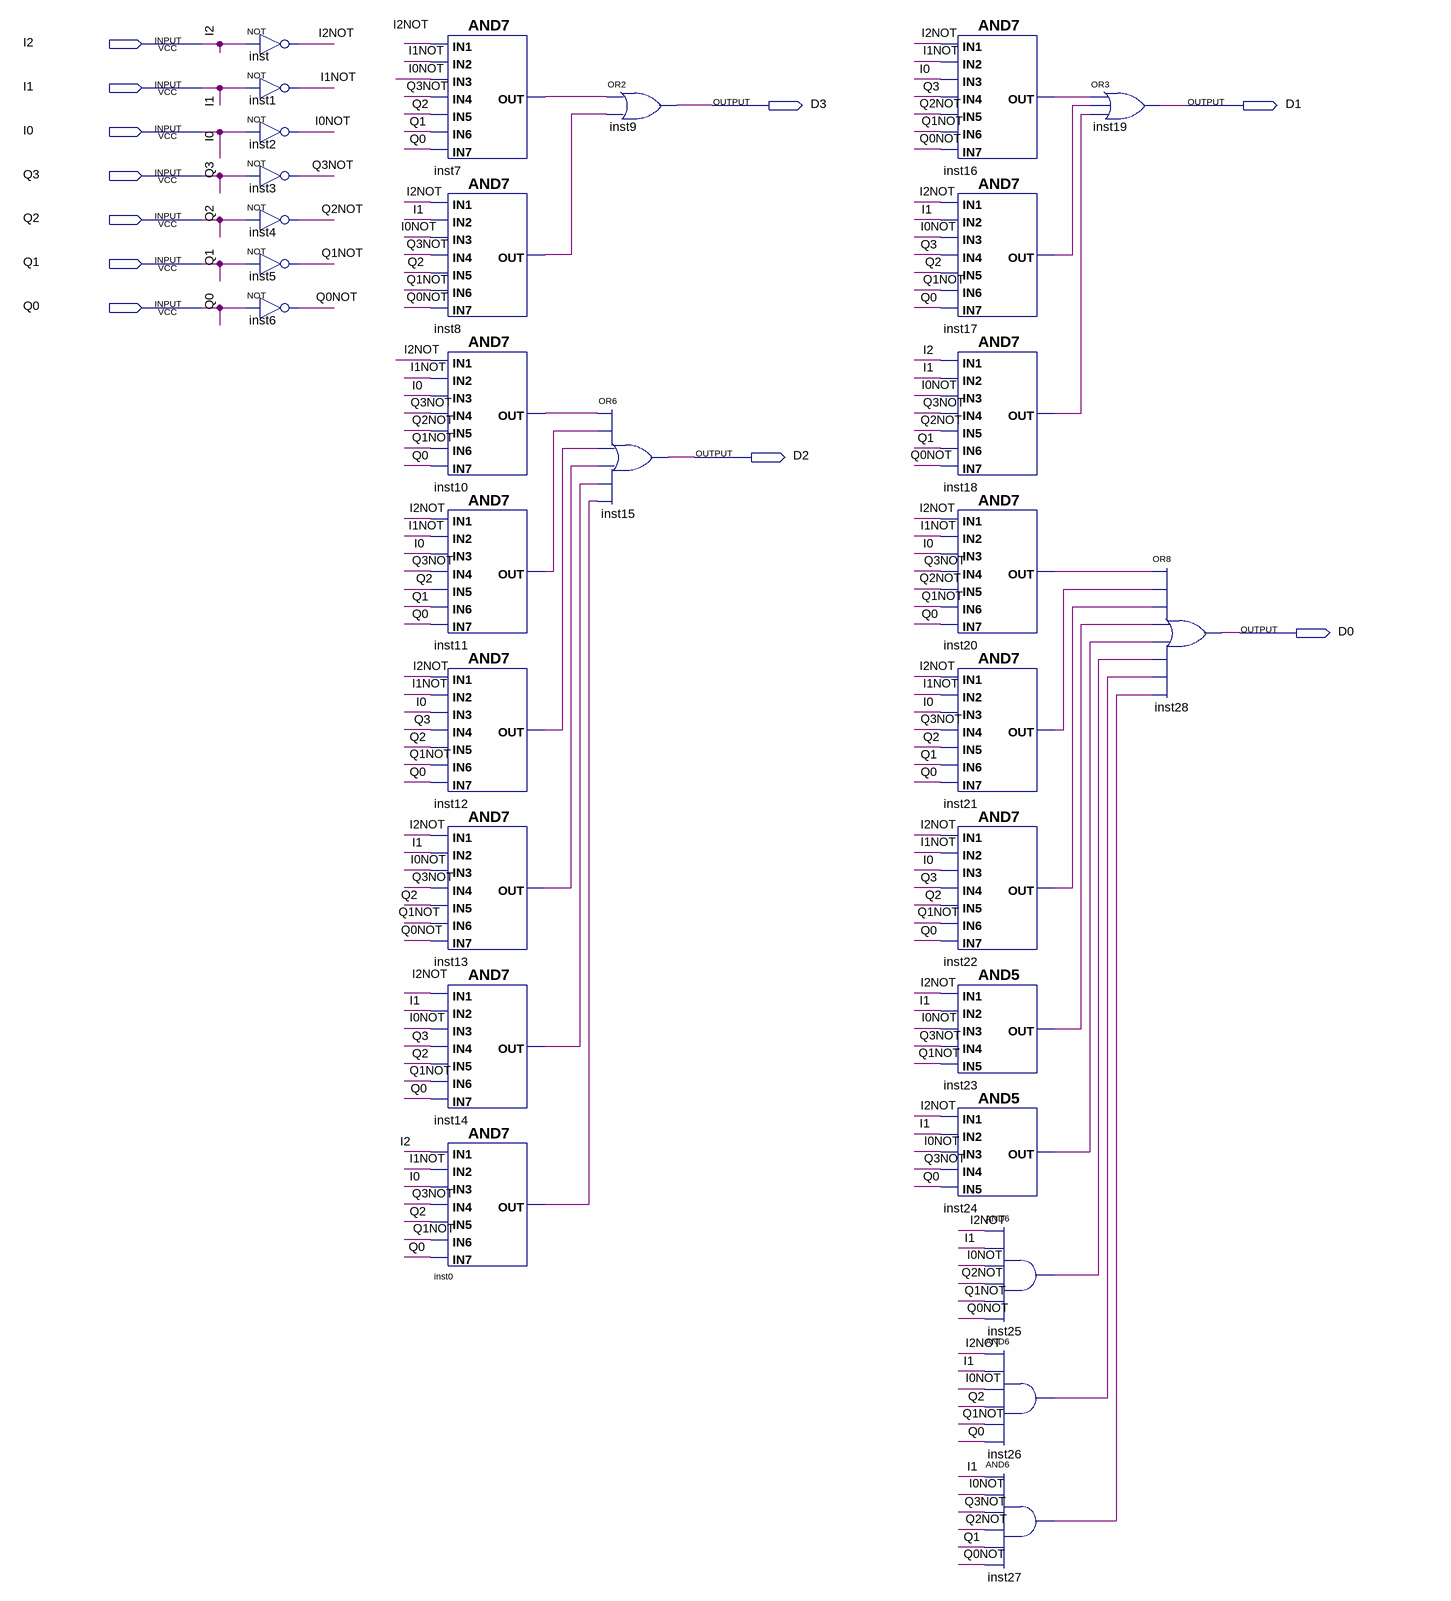
[diagram p0: schematic sheet]
// Quartus schematic NEXTSTATE.bdf as structural Verilog: 30 symbols, 11 pins
module NEXTSTATE (
  input  I2,
  input  I1,
  input  I0,
  input  Q3,
  input  Q2,
  input  Q1,
  input  Q0,
  output D3,
  output D1,
  output D2,
  output D0
);

  wire I0NOT, I1NOT, I2NOT, inst0_out, inst7_out, inst8_out, inst10_out, inst11_out, inst12_out, inst13_out,
       inst14_out, inst16_out, inst17_out, inst18_out, inst20_out, inst21_out, inst22_out, inst23_out,
       inst24_out, inst25_out, inst26_out, inst27_out, Q0NOT, Q1NOT, Q2NOT, Q3NOT;

  not inst (I2NOT, I2);
  not inst1 (I1NOT, I1);
  not inst2 (I0NOT, I0);
  not inst3 (Q3NOT, Q3);
  not inst4 (Q2NOT, Q2);
  not inst5 (Q1NOT, Q1);
  not inst6 (Q0NOT, Q0);
  and inst7 (inst7_out, I2NOT, I1NOT, I0NOT, Q3NOT, Q2, Q1, Q0);
  and inst8 (inst8_out, I2NOT, I1, I0NOT, Q3NOT, Q2, Q1NOT, Q0NOT);
  and inst10 (inst10_out, I2NOT, I1NOT, I0, Q3NOT, Q2NOT, Q1NOT, Q0);
  and inst11 (inst11_out, I2NOT, I1NOT, I0, Q3NOT, Q2, Q1, Q0);
  and inst12 (inst12_out, I2NOT, I1NOT, I0, Q3, Q2, Q1NOT, Q0);
  and inst13 (inst13_out, I2NOT, I1, I0NOT, Q3NOT, Q2, Q1NOT, Q0NOT);
  and inst14 (inst14_out, I2NOT, I1, I0NOT, Q3, Q2, Q1NOT, Q0);
  and inst0 (inst0_out, I2, I1NOT, I0, Q3NOT, Q2, Q1NOT, Q0);
  or inst9 (D3, inst7_out, inst8_out);
  or inst15 (D2, inst10_out, inst11_out, inst12_out, inst13_out, inst14_out, inst0_out);
  and inst16 (inst16_out, I2NOT, I1NOT, I0, Q3, Q2NOT, Q1NOT, Q0NOT);
  and inst17 (inst17_out, I2NOT, I1, I0NOT, Q3, Q2, Q1NOT, Q0);
  and inst18 (inst18_out, I2, I1, I0NOT, Q3NOT, Q2NOT, Q1, Q0NOT);
  and inst20 (inst20_out, I2NOT, I1NOT, I0, Q3NOT, Q2NOT, Q1NOT, Q0);
  and inst21 (inst21_out, I2NOT, I1NOT, I0, Q3NOT, Q2, Q1, Q0);
  and inst22 (inst22_out, I2NOT, I1NOT, I0, Q3, Q2, Q1NOT, Q0);
  and inst23 (inst23_out, I2NOT, I1, I0NOT, Q3NOT, Q1NOT);
  and inst24 (inst24_out, I2NOT, I1, I0NOT, Q3NOT, Q0);
  and inst25 (inst25_out, I2NOT, I1, I0NOT, Q2NOT, Q1NOT, Q0NOT);
  and inst26 (inst26_out, I2NOT, I1, I0NOT, Q2, Q1NOT, Q0);
  and inst27 (inst27_out, I1, I0NOT, Q3NOT, Q2NOT, Q1, Q0NOT);
  or inst19 (D1, inst16_out, inst17_out, inst18_out);
  or inst28 (D0, inst20_out, inst21_out, inst22_out, inst23_out, inst24_out, inst25_out, inst26_out, inst27_out);
endmodule
